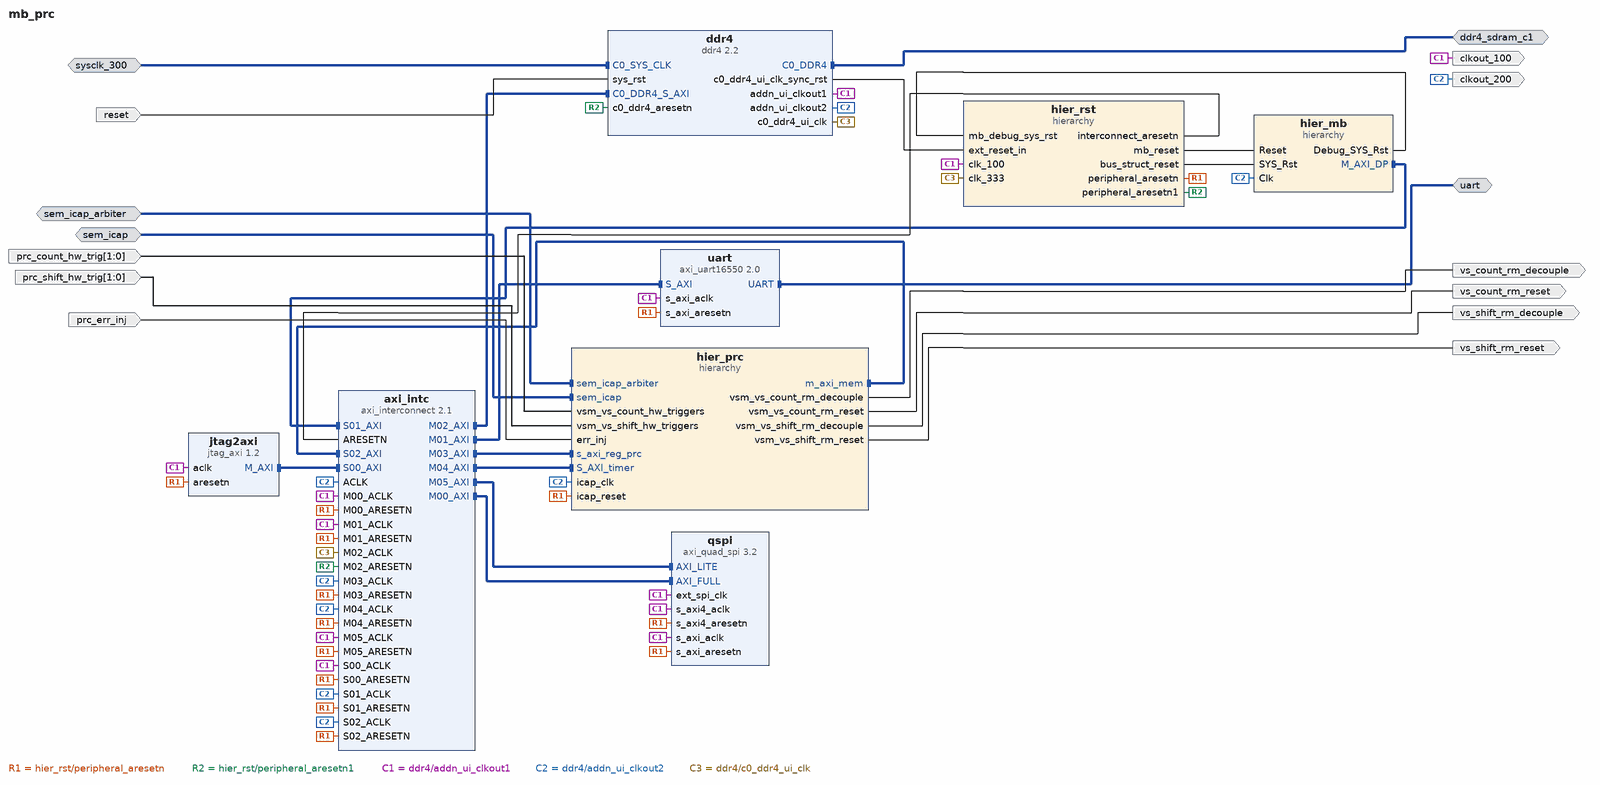
[diagram p0: block diagram of the top level]
# Vivado block design mb_prc, xcku5p-ffvb676-2-e, Vivado 2019.2
create_bd_design mb_prc

create_bd_intf_port -mode Master -vlnv xilinx.com:interface:ddr4_rtl:1.0 ddr4_sdram_c1
create_bd_intf_port -mode Slave -vlnv xilinx.com:interface:icap_rtl:1.0 sem_icap
create_bd_intf_port -mode Slave -vlnv xilinx.com:interface:cap_rtl:1.0 sem_icap_arbiter
create_bd_intf_port -mode Slave -vlnv xilinx.com:interface:diff_clock_rtl:1.0 sysclk_300
set_property -dict {CONFIG.FREQ_HZ 300000000} [get_bd_intf_ports sysclk_300]
create_bd_intf_port -mode Master -vlnv xilinx.com:interface:uart_rtl:1.0 uart
create_bd_port -dir I -type rst reset
set_property -dict {CONFIG.POLARITY ACTIVE_HIGH} [get_bd_ports reset]
create_bd_port -dir O -type clk clkout_100
create_bd_port -dir O -type clk clkout_200
create_bd_port -dir O vs_count_rm_decouple
create_bd_port -dir O vs_count_rm_reset
create_bd_port -dir O vs_shift_rm_decouple
create_bd_port -dir O vs_shift_rm_reset
create_bd_port -dir I -from 1 -to 0 prc_count_hw_trig
create_bd_port -dir I -from 1 -to 0 prc_shift_hw_trig
create_bd_port -dir I prc_err_inj

create_bd_cell -type hier hier_mb
create_bd_cell -type hier hier_prc
create_bd_cell -type hier hier_rst
create_bd_cell -type ip -vlnv xilinx.com:ip:axi_interconnect:2.1 axi_intc
set_property -dict {CONFIG.NUM_MI 6 CONFIG.NUM_SI 3 CONFIG.SYNCHRONIZATION_STAGES 2} [get_bd_cells axi_intc]
create_bd_cell -type ip -vlnv xilinx.com:ip:ddr4:2.2 ddr4
set_property -dict [list \
  CONFIG.ADDN_UI_CLKOUT1_FREQ_HZ 100 \
  CONFIG.ADDN_UI_CLKOUT2_FREQ_HZ 200 \
  CONFIG.C0.BANK_GROUP_WIDTH 1 \
  CONFIG.C0.DDR4_AxiAddressWidth 30 \
  CONFIG.C0_CLOCK_BOARD_INTERFACE default_sysclk1_300 \
  CONFIG.C0_DDR4_BOARD_INTERFACE ddr4_sdram_c1 \
  CONFIG.RESET_BOARD_INTERFACE reset \
] [get_bd_cells ddr4]
create_bd_cell -type ip -vlnv xilinx.com:ip:jtag_axi:1.2 jtag2axi
create_bd_cell -type ip -vlnv xilinx.com:ip:axi_quad_spi:3.2 qspi
set_property -dict [list \
  CONFIG.C_SPI_MEMORY 2 \
  CONFIG.C_SPI_MEM_ADDR_BITS 32 \
  CONFIG.C_SPI_MODE 2 \
  CONFIG.C_TYPE_OF_AXI4_INTERFACE 1 \
  CONFIG.C_USE_STARTUP 1 \
  CONFIG.C_USE_STARTUP_INT 1 \
  CONFIG.C_XIP_MODE 1 \
] [get_bd_cells qspi]
create_bd_cell -type ip -vlnv xilinx.com:ip:axi_uart16550:2.0 uart
set_property -dict {CONFIG.UART_BOARD_INTERFACE rs232_uart CONFIG.USE_BOARD_FLOW true} [get_bd_cells uart]

# ---- hierarchy /hier_mb ----
current_bd_instance /hier_mb
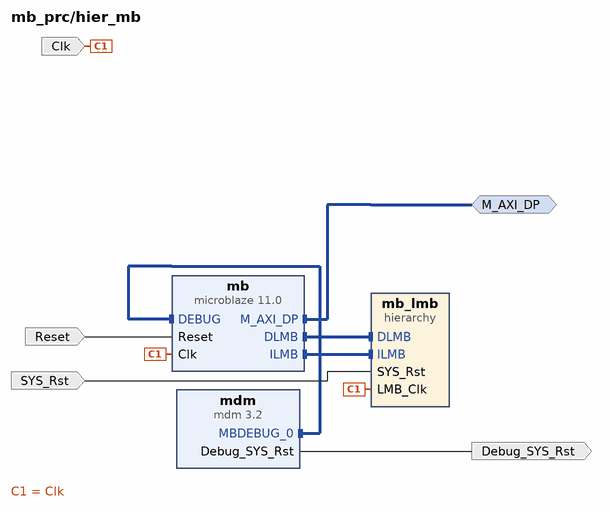
[diagram p1: block diagram inside /hier_mb]
create_bd_intf_pin -mode Master -vlnv xilinx.com:interface:aximm_rtl:1.0 M_AXI_DP
create_bd_pin -dir I -type clk Clk
create_bd_pin -dir I -type rst Reset
create_bd_pin -dir I SYS_Rst
create_bd_pin -dir O -type rst Debug_SYS_Rst

create_bd_cell -type hier mb_lmb
create_bd_cell -type ip -vlnv xilinx.com:ip:microblaze:11.0 mb
set_property -dict {CONFIG.C_DEBUG_ENABLED 1 CONFIG.C_D_AXI 1 CONFIG.C_D_LMB 1 CONFIG.C_I_LMB 1} [get_bd_cells mb]
create_bd_cell -type ip -vlnv xilinx.com:ip:mdm:3.2 mdm

# ---- hierarchy /hier_mb/mb_lmb ----
current_bd_instance /hier_mb/mb_lmb
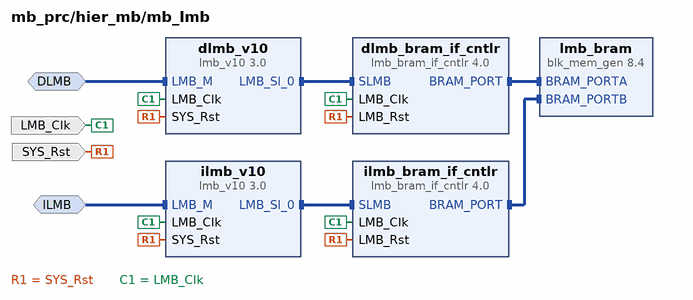
[diagram p2: block diagram inside /hier_mb/mb_lmb]
create_bd_intf_pin -mode MirroredMaster -vlnv xilinx.com:interface:lmb_rtl:1.0 DLMB
create_bd_intf_pin -mode MirroredMaster -vlnv xilinx.com:interface:lmb_rtl:1.0 ILMB
create_bd_pin -dir I -type clk LMB_Clk
create_bd_pin -dir I -type rst SYS_Rst

create_bd_cell -type ip -vlnv xilinx.com:ip:lmb_v10:3.0 dlmb_v10
create_bd_cell -type ip -vlnv xilinx.com:ip:lmb_v10:3.0 ilmb_v10
create_bd_cell -type ip -vlnv xilinx.com:ip:lmb_bram_if_cntlr:4.0 dlmb_bram_if_cntlr
set_property -dict {CONFIG.C_ECC 0} [get_bd_cells dlmb_bram_if_cntlr]
create_bd_cell -type ip -vlnv xilinx.com:ip:lmb_bram_if_cntlr:4.0 ilmb_bram_if_cntlr
set_property -dict {CONFIG.C_ECC 0} [get_bd_cells ilmb_bram_if_cntlr]
create_bd_cell -type ip -vlnv xilinx.com:ip:blk_mem_gen:8.4 lmb_bram
set_property -dict [list \
  CONFIG.EN_SAFETY_CKT false \
  CONFIG.Enable_B Use_ENB_Pin \
  CONFIG.Memory_Type True_Dual_Port_RAM \
  CONFIG.Port_B_Clock 100 \
  CONFIG.Port_B_Enable_Rate 100 \
  CONFIG.Port_B_Write_Rate 50 \
  CONFIG.Use_RSTB_Pin true \
  CONFIG.use_bram_block BRAM_Controller \
] [get_bd_cells lmb_bram]

# ---- hierarchy /hier_prc ----
current_bd_instance /hier_prc
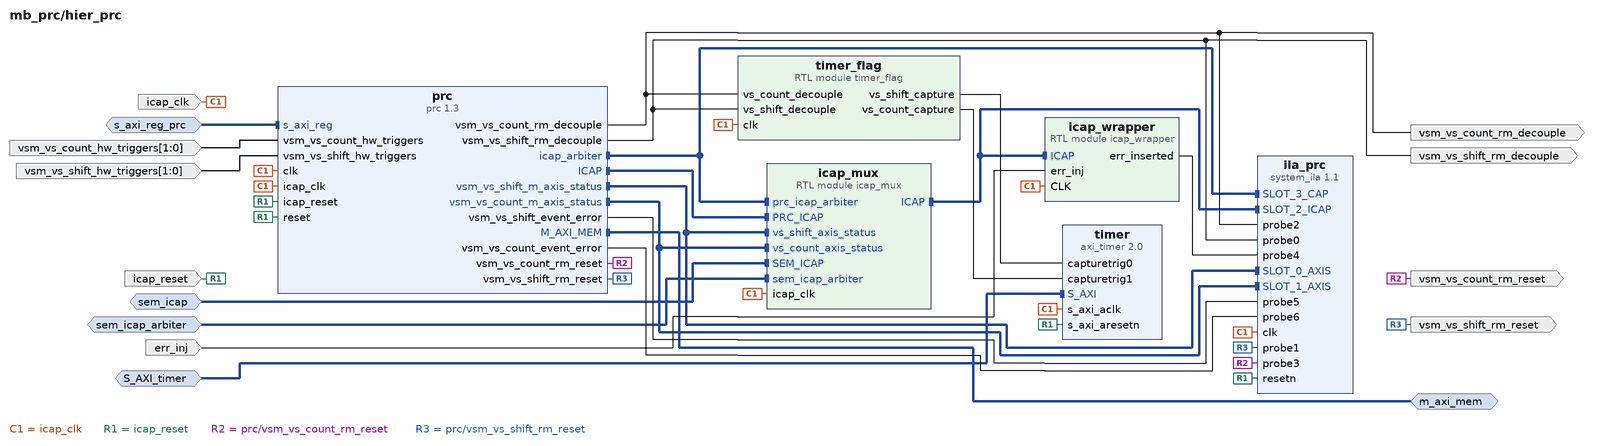
[diagram p3: block diagram inside /hier_prc]
create_bd_intf_pin -mode Master -vlnv xilinx.com:interface:aximm_rtl:1.0 m_axi_mem
create_bd_intf_pin -mode Slave -vlnv xilinx.com:interface:aximm_rtl:1.0 S_AXI_timer
create_bd_intf_pin -mode Slave -vlnv xilinx.com:interface:aximm_rtl:1.0 s_axi_reg_prc
create_bd_intf_pin -mode Slave -vlnv xilinx.com:interface:icap_rtl:1.0 sem_icap
create_bd_intf_pin -mode Slave -vlnv xilinx.com:interface:cap_rtl:1.0 sem_icap_arbiter
create_bd_pin -dir I -type clk icap_clk
create_bd_pin -dir I -type rst icap_reset
create_bd_pin -dir I -from 1 -to 0 vsm_vs_count_hw_triggers
create_bd_pin -dir I -from 1 -to 0 vsm_vs_shift_hw_triggers
create_bd_pin -dir I err_inj
create_bd_pin -dir O vsm_vs_count_rm_decouple
create_bd_pin -dir O vsm_vs_count_rm_reset
create_bd_pin -dir O vsm_vs_shift_rm_decouple
create_bd_pin -dir O vsm_vs_shift_rm_reset

create_bd_cell -type module -reference icap_wrapper icap_wrapper
create_bd_cell -type module -reference timer_flag timer_flag
create_bd_cell -type module -reference icap_mux icap_mux
create_bd_cell -type ip -vlnv xilinx.com:ip:system_ila:1.1 ila_prc
set_property -dict [list \
  CONFIG.C_MON_TYPE MIX \
  CONFIG.C_NUM_MONITOR_SLOTS 4 \
  CONFIG.C_NUM_OF_PROBES 7 \
  CONFIG.C_SLOT 3 \
  CONFIG.C_SLOT_0_INTF_TYPE xilinx.com:interface:axis_rtl:1.0 \
  CONFIG.C_SLOT_1_INTF_TYPE xilinx.com:interface:axis_rtl:1.0 \
  CONFIG.C_SLOT_2_INTF_TYPE xilinx.com:interface:icap_rtl:1.0 \
  CONFIG.C_SLOT_3_INTF_TYPE xilinx.com:interface:cap_rtl:1.0 \
] [get_bd_cells ila_prc]
create_bd_cell -type ip -vlnv xilinx.com:ip:prc:1.3 prc
set_property -dict [list \
  CONFIG.ALL_PARAMS {HAS_AXI_LITE_IF 1 RESET_ACTIVE_LEVEL 0 CP_FIFO_DEPTH 32 CP_FIFO_TYPE lutram CDC_STAGES 6 VS {vs_shift {ID 0 NAME vs_shift RM {rm_shift_right {ID 0 NAME rm_shift_right BS {0 {ID 0 ADDR 0 SIZE 0 CLEAR 0}} RESET_REQUIRED high} rm_shift_left {ID 1 NAME rm_shift_left BS {0 {ID 0 ADDR 0 SIZE 0 CLEAR 0}} RESET_REQUIRED high}} POR_RM rm_shift_right NUM_HW_TRIGGERS 2 HAS_POR_RM 1 HAS_AXIS_CONTROL 0 HAS_AXIS_STATUS 1} vs_count {ID 1 NAME vs_count RM {rm_count_up {ID 0 NAME rm_count_up BS {0 {ID 0 ADDR 0 SIZE 0 CLEAR 0}} RESET_REQUIRED high} rm_count_down {ID 1 NAME rm_count_down BS {0 {ID 0 ADDR 0 SIZE 0 CLEAR 0}} RESET_REQUIRED high}} NUM_HW_TRIGGERS 2 HAS_POR_RM 1 POR_RM rm_count_up HAS_AXIS_STATUS 1}} CP_FAMILY ultrascale_plus DIRTY 0 CP_ARBITRATION_PROTOCOL 1 CP_COMPRESSION 0} \
  CONFIG.GUI_CP_ARBITRATION_PROTOCOL 1 \
  CONFIG.GUI_RM_NEW_NAME rm_count_up \
  CONFIG.GUI_RM_RESET_REQUIRED high \
  CONFIG.GUI_SELECT_RM 0 \
  CONFIG.GUI_SELECT_TRIGGER_0 0 \
  CONFIG.GUI_SELECT_TRIGGER_1 1 \
  CONFIG.GUI_SELECT_TRIGGER_2 0 \
  CONFIG.GUI_SELECT_TRIGGER_3 1 \
  CONFIG.GUI_SELECT_VS 1 \
  CONFIG.GUI_VS_HAS_AXIS_CONTROL false \
  CONFIG.GUI_VS_HAS_AXIS_STATUS true \
  CONFIG.GUI_VS_HAS_POR_RM true \
  CONFIG.GUI_VS_NEW_NAME vs_count \
  CONFIG.GUI_VS_NUM_HW_TRIGGERS 2 \
  CONFIG.GUI_VS_POR_RM 0 \
] [get_bd_cells prc]
create_bd_cell -type ip -vlnv xilinx.com:ip:axi_timer:2.0 timer

# ---- hierarchy /hier_rst ----
current_bd_instance /hier_rst
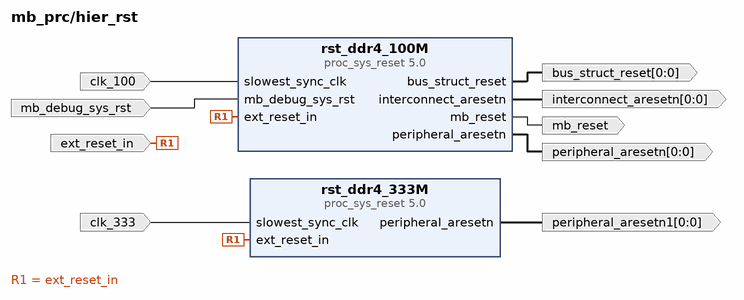
[diagram p4: block diagram inside /hier_rst]
create_bd_pin -dir I -type clk clk_100
create_bd_pin -dir I -type clk clk_333
create_bd_pin -dir I -type rst ext_reset_in
create_bd_pin -dir I -type rst mb_debug_sys_rst
create_bd_pin -dir O -type rst mb_reset
create_bd_pin -dir O -from 0 -to 0 -type rst bus_struct_reset
create_bd_pin -dir O -from 0 -to 0 -type rst interconnect_aresetn
create_bd_pin -dir O -from 0 -to 0 -type rst peripheral_aresetn
create_bd_pin -dir O -from 0 -to 0 -type rst peripheral_aresetn1

create_bd_cell -type ip -vlnv xilinx.com:ip:proc_sys_reset:5.0 rst_ddr4_100M
create_bd_cell -type ip -vlnv xilinx.com:ip:proc_sys_reset:5.0 rst_ddr4_333M
set_property -dict {CONFIG.RESET_BOARD_INTERFACE reset CONFIG.USE_BOARD_FLOW true} [get_bd_cells rst_ddr4_333M]

# ---- connections ----

current_bd_instance /hier_mb
connect_bd_intf_net [get_bd_intf_pins mb_lmb/DLMB] [get_bd_intf_pins mb/DLMB]
connect_bd_intf_net [get_bd_intf_pins mb_lmb/ILMB] [get_bd_intf_pins mb/ILMB]
connect_bd_intf_net [get_bd_intf_pins mdm/MBDEBUG_0] [get_bd_intf_pins mb/DEBUG]
connect_bd_intf_net [get_bd_intf_pins M_AXI_DP] [get_bd_intf_pins mb/M_AXI_DP]
connect_bd_net [get_bd_pins SYS_Rst] [get_bd_pins mb_lmb/SYS_Rst]
connect_bd_net [get_bd_pins mdm/Debug_SYS_Rst] [get_bd_pins Debug_SYS_Rst]
connect_bd_net -net mb_clk [get_bd_pins Clk] [get_bd_pins mb_lmb/LMB_Clk] [get_bd_pins mb/Clk]
connect_bd_net -net mb_reset [get_bd_pins Reset] [get_bd_pins mb/Reset]
set_property HDL_ATTRIBUTE.BMM_INFO_PROCESSOR {microblaze-le > mb_prc hier_mb/mb_lmb/dlmb_bram_if_cntlr} [get_bd_cells mb]
set_property HDL_ATTRIBUTE.KEEP_HIERARCHY yes [get_bd_cells mb]

current_bd_instance /hier_mb/mb_lmb
connect_bd_intf_net -intf_net mb_dlmb_bus [get_bd_intf_pins dlmb_bram_if_cntlr/SLMB] [get_bd_intf_pins dlmb_v10/LMB_Sl_0]
connect_bd_intf_net -intf_net mb_ilmb [get_bd_intf_pins ILMB] [get_bd_intf_pins ilmb_v10/LMB_M]
connect_bd_intf_net -intf_net mb_dlmb_cntlr [get_bd_intf_pins dlmb_bram_if_cntlr/BRAM_PORT] [get_bd_intf_pins lmb_bram/BRAM_PORTA]
connect_bd_intf_net -intf_net mb_dlmb [get_bd_intf_pins DLMB] [get_bd_intf_pins dlmb_v10/LMB_M]
connect_bd_intf_net -intf_net mb_ilmb_cntlr [get_bd_intf_pins ilmb_bram_if_cntlr/BRAM_PORT] [get_bd_intf_pins lmb_bram/BRAM_PORTB]
connect_bd_intf_net -intf_net mb_ilmb_bus [get_bd_intf_pins ilmb_bram_if_cntlr/SLMB] [get_bd_intf_pins ilmb_v10/LMB_Sl_0]
connect_bd_net [get_bd_pins SYS_Rst] \
  [get_bd_pins dlmb_v10/SYS_Rst] [get_bd_pins ilmb_v10/SYS_Rst] [get_bd_pins dlmb_bram_if_cntlr/LMB_Rst] \
  [get_bd_pins ilmb_bram_if_cntlr/LMB_Rst]
connect_bd_net -net mb_clk [get_bd_pins LMB_Clk] \
  [get_bd_pins dlmb_v10/LMB_Clk] [get_bd_pins ilmb_v10/LMB_Clk] [get_bd_pins dlmb_bram_if_cntlr/LMB_Clk] \
  [get_bd_pins ilmb_bram_if_cntlr/LMB_Clk]
set_property HDL_ATTRIBUTE.BMM_INFO_ADDRESS_SPACE {byte  0x00000000 32 > mb_prc hier_mb/mb_lmb/lmb_bram} [get_bd_cells dlmb_bram_if_cntlr]
set_property HDL_ATTRIBUTE.KEEP_HIERARCHY yes [get_bd_cells dlmb_bram_if_cntlr]

current_bd_instance /hier_prc
connect_bd_intf_net -intf_net prc_axi4_reg [get_bd_intf_pins s_axi_reg_prc] [get_bd_intf_pins prc/s_axi_reg]
connect_bd_intf_net [get_bd_intf_pins S_AXI_timer] [get_bd_intf_pins timer/S_AXI]
connect_bd_intf_net [get_bd_intf_pins sem_icap] [get_bd_intf_pins icap_mux/SEM_ICAP]
connect_bd_intf_net [get_bd_intf_pins icap_mux/prc_icap_arbiter] [get_bd_intf_pins prc/icap_arbiter]
connect_bd_intf_net [get_bd_intf_pins icap_mux/prc_icap_arbiter] [get_bd_intf_pins ila_prc/SLOT_3_CAP]
connect_bd_intf_net [get_bd_intf_pins prc/vsm_vs_shift_m_axis_status] [get_bd_intf_pins icap_mux/vs_shift_axis_status]
connect_bd_intf_net [get_bd_intf_pins prc/vsm_vs_shift_m_axis_status] [get_bd_intf_pins ila_prc/SLOT_0_AXIS]
connect_bd_intf_net [get_bd_intf_pins icap_mux/PRC_ICAP] [get_bd_intf_pins prc/ICAP]
connect_bd_intf_net [get_bd_intf_pins sem_icap_arbiter] [get_bd_intf_pins icap_mux/sem_icap_arbiter]
connect_bd_intf_net [get_bd_intf_pins m_axi_mem] [get_bd_intf_pins prc/M_AXI_MEM]
connect_bd_intf_net [get_bd_intf_pins icap_mux/ICAP] [get_bd_intf_pins icap_wrapper/ICAP]
connect_bd_intf_net [get_bd_intf_pins icap_mux/ICAP] [get_bd_intf_pins ila_prc/SLOT_2_ICAP]
connect_bd_intf_net [get_bd_intf_pins prc/vsm_vs_count_m_axis_status] [get_bd_intf_pins icap_mux/vs_count_axis_status]
connect_bd_intf_net [get_bd_intf_pins prc/vsm_vs_count_m_axis_status] [get_bd_intf_pins ila_prc/SLOT_1_AXIS]
connect_bd_net -net clk_200 [get_bd_pins icap_clk] \
  [get_bd_pins icap_wrapper/CLK] [get_bd_pins timer_flag/clk] [get_bd_pins icap_mux/icap_clk] [get_bd_pins ila_prc/clk] \
  [get_bd_pins prc/clk] [get_bd_pins prc/icap_clk] [get_bd_pins timer/s_axi_aclk]
connect_bd_net -net rst_peripheral_aresetn [get_bd_pins icap_reset] \
  [get_bd_pins ila_prc/resetn] [get_bd_pins prc/reset] [get_bd_pins prc/icap_reset] [get_bd_pins timer/s_axi_aresetn]
connect_bd_net [get_bd_pins err_inj] [get_bd_pins icap_wrapper/err_inj]
connect_bd_net -net icap_err_inserted [get_bd_pins icap_wrapper/err_inserted] [get_bd_pins ila_prc/probe4]
connect_bd_net -net prc_vs_count_rm_decouple [get_bd_pins prc/vsm_vs_count_rm_decouple] \
  [get_bd_pins vsm_vs_count_rm_decouple] [get_bd_pins timer_flag/vs_count_decouple] [get_bd_pins ila_prc/probe2]
connect_bd_net -net prc_vs_count_rm_reset [get_bd_pins prc/vsm_vs_count_rm_reset] [get_bd_pins vsm_vs_count_rm_reset] [get_bd_pins ila_prc/probe3]
connect_bd_net -net prc_vs_shift_rm_decouple [get_bd_pins prc/vsm_vs_shift_rm_decouple] \
  [get_bd_pins vsm_vs_shift_rm_decouple] [get_bd_pins timer_flag/vs_shift_decouple] [get_bd_pins ila_prc/probe0]
connect_bd_net -net prc_vs_shift_rm_reset [get_bd_pins prc/vsm_vs_shift_rm_reset] [get_bd_pins vsm_vs_shift_rm_reset] [get_bd_pins ila_prc/probe1]
connect_bd_net [get_bd_pins vsm_vs_count_hw_triggers] [get_bd_pins prc/vsm_vs_count_hw_triggers]
connect_bd_net [get_bd_pins vsm_vs_shift_hw_triggers] [get_bd_pins prc/vsm_vs_shift_hw_triggers]
connect_bd_net [get_bd_pins prc/vsm_vs_shift_event_error] [get_bd_pins ila_prc/probe5]
connect_bd_net [get_bd_pins prc/vsm_vs_count_event_error] [get_bd_pins ila_prc/probe6]
connect_bd_net [get_bd_pins timer_flag/vs_shift_capture] [get_bd_pins timer/capturetrig0]
connect_bd_net [get_bd_pins timer_flag/vs_count_capture] [get_bd_pins timer/capturetrig1]

current_bd_instance /hier_rst
connect_bd_net -net peripheral_aresetn [get_bd_pins rst_ddr4_100M/peripheral_aresetn] [get_bd_pins peripheral_aresetn]
connect_bd_net -net peripheral_aresetn1 [get_bd_pins rst_ddr4_333M/peripheral_aresetn] [get_bd_pins peripheral_aresetn1]
connect_bd_net -net SYS_Rst_1 [get_bd_pins rst_ddr4_100M/bus_struct_reset] [get_bd_pins bus_struct_reset]
connect_bd_net -net reset [get_bd_pins ext_reset_in] [get_bd_pins rst_ddr4_100M/ext_reset_in] [get_bd_pins rst_ddr4_333M/ext_reset_in]
connect_bd_net [get_bd_pins clk_100] [get_bd_pins rst_ddr4_100M/slowest_sync_clk]
connect_bd_net [get_bd_pins clk_333] [get_bd_pins rst_ddr4_333M/slowest_sync_clk]
connect_bd_net -net hier_mb_Debug_SYS_Rst [get_bd_pins mb_debug_sys_rst] [get_bd_pins rst_ddr4_100M/mb_debug_sys_rst]
connect_bd_net [get_bd_pins rst_ddr4_100M/interconnect_aresetn] [get_bd_pins interconnect_aresetn]
connect_bd_net [get_bd_pins rst_ddr4_100M/mb_reset] [get_bd_pins mb_reset]

current_bd_instance /
connect_bd_intf_net [get_bd_intf_pins axi_intc/M01_AXI] [get_bd_intf_pins uart/S_AXI]
connect_bd_intf_net -intf_net axi_uart16550_UART [get_bd_intf_ports uart] [get_bd_intf_pins uart/UART]
connect_bd_intf_net [get_bd_intf_pins axi_intc/M03_AXI] [get_bd_intf_pins hier_prc/s_axi_reg_prc]
connect_bd_intf_net [get_bd_intf_pins axi_intc/S01_AXI] [get_bd_intf_pins hier_mb/M_AXI_DP]
connect_bd_intf_net [get_bd_intf_pins axi_intc/M05_AXI] [get_bd_intf_pins qspi/AXI_LITE]
connect_bd_intf_net [get_bd_intf_ports sem_icap_arbiter] [get_bd_intf_pins hier_prc/sem_icap_arbiter]
connect_bd_intf_net -intf_net default_sysclk1_300_1 [get_bd_intf_ports sysclk_300] [get_bd_intf_pins ddr4/C0_SYS_CLK]
connect_bd_intf_net [get_bd_intf_pins axi_intc/S00_AXI] [get_bd_intf_pins jtag2axi/M_AXI]
connect_bd_intf_net [get_bd_intf_pins axi_intc/M04_AXI] [get_bd_intf_pins hier_prc/S_AXI_timer]
connect_bd_intf_net [get_bd_intf_pins axi_intc/M00_AXI] [get_bd_intf_pins qspi/AXI_FULL]
connect_bd_intf_net [get_bd_intf_pins axi_intc/M02_AXI] [get_bd_intf_pins ddr4/C0_DDR4_S_AXI]
connect_bd_intf_net [get_bd_intf_pins axi_intc/S02_AXI] [get_bd_intf_pins hier_prc/m_axi_mem]
connect_bd_intf_net [get_bd_intf_ports sem_icap] [get_bd_intf_pins hier_prc/sem_icap]
connect_bd_intf_net [get_bd_intf_ports ddr4_sdram_c1] [get_bd_intf_pins ddr4/C0_DDR4]
connect_bd_net [get_bd_ports reset] [get_bd_pins ddr4/sys_rst]
connect_bd_net -net rst_100M_interconnect_aresetn [get_bd_pins hier_rst/interconnect_aresetn] [get_bd_pins axi_intc/ARESETN]
connect_bd_net -net rst_100M_mb_reset [get_bd_pins hier_rst/mb_reset] [get_bd_pins hier_mb/Reset]
connect_bd_net -net rst_100M_peripheral_aresetn [get_bd_pins hier_rst/peripheral_aresetn] \
  [get_bd_pins hier_prc/icap_reset] [get_bd_pins axi_intc/S00_ARESETN] [get_bd_pins axi_intc/M00_ARESETN] \
  [get_bd_pins axi_intc/M01_ARESETN] [get_bd_pins axi_intc/S01_ARESETN] [get_bd_pins axi_intc/S02_ARESETN] \
  [get_bd_pins axi_intc/M03_ARESETN] [get_bd_pins axi_intc/M04_ARESETN] [get_bd_pins axi_intc/M05_ARESETN] \
  [get_bd_pins jtag2axi/aresetn] [get_bd_pins qspi/s_axi_aresetn] [get_bd_pins qspi/s_axi4_aresetn] \
  [get_bd_pins uart/s_axi_aresetn]
connect_bd_net -net rst_333M_peripheral_aresetn [get_bd_pins hier_rst/peripheral_aresetn1] \
  [get_bd_pins axi_intc/M02_ARESETN] [get_bd_pins ddr4/c0_ddr4_aresetn]
connect_bd_net -net mb_SYS_Rst [get_bd_pins hier_rst/bus_struct_reset] [get_bd_pins hier_mb/SYS_Rst]
connect_bd_net -net ddr4_ui_clk_sync_rst [get_bd_pins ddr4/c0_ddr4_ui_clk_sync_rst] [get_bd_pins hier_rst/ext_reset_in]
connect_bd_net [get_bd_pins hier_mb/Debug_SYS_Rst] [get_bd_pins hier_rst/mb_debug_sys_rst]
connect_bd_net -net clk_100 [get_bd_pins ddr4/addn_ui_clkout1] \
  [get_bd_ports clkout_100] [get_bd_pins hier_rst/clk_100] [get_bd_pins axi_intc/S00_ACLK] [get_bd_pins axi_intc/M00_ACLK] \
  [get_bd_pins axi_intc/M01_ACLK] [get_bd_pins axi_intc/M05_ACLK] [get_bd_pins jtag2axi/aclk] [get_bd_pins qspi/ext_spi_clk] \
  [get_bd_pins qspi/s_axi_aclk] [get_bd_pins qspi/s_axi4_aclk] [get_bd_pins uart/s_axi_aclk]
connect_bd_net -net clk_200 [get_bd_pins ddr4/addn_ui_clkout2] \
  [get_bd_ports clkout_200] [get_bd_pins hier_mb/Clk] [get_bd_pins hier_prc/icap_clk] [get_bd_pins axi_intc/ACLK] \
  [get_bd_pins axi_intc/S01_ACLK] [get_bd_pins axi_intc/S02_ACLK] [get_bd_pins axi_intc/M03_ACLK] \
  [get_bd_pins axi_intc/M04_ACLK]
connect_bd_net -net clk_333 [get_bd_pins ddr4/c0_ddr4_ui_clk] [get_bd_pins hier_rst/clk_333] [get_bd_pins axi_intc/M02_ACLK]
connect_bd_net [get_bd_pins hier_prc/vsm_vs_count_rm_decouple] [get_bd_ports vs_count_rm_decouple]
connect_bd_net [get_bd_pins hier_prc/vsm_vs_count_rm_reset] [get_bd_ports vs_count_rm_reset]
connect_bd_net [get_bd_pins hier_prc/vsm_vs_shift_rm_decouple] [get_bd_ports vs_shift_rm_decouple]
connect_bd_net [get_bd_pins hier_prc/vsm_vs_shift_rm_reset] [get_bd_ports vs_shift_rm_reset]
connect_bd_net -net vsm_vs_count_hw_triggers [get_bd_ports prc_count_hw_trig] [get_bd_pins hier_prc/vsm_vs_count_hw_triggers]
connect_bd_net -net vsm_vs_shift_hw_triggers [get_bd_ports prc_shift_hw_trig] [get_bd_pins hier_prc/vsm_vs_shift_hw_triggers]
connect_bd_net -net err_inj [get_bd_ports prc_err_inj] [get_bd_pins hier_prc/err_inj]

# ---- address map ----
assign_bd_address -offset 0x00000000 -range 64K -target_address_space [get_bd_addr_spaces hier_mb/mb/Data] [get_bd_addr_segs hier_mb/mb_lmb/dlmb_bram_if_cntlr/SLMB/Mem]
assign_bd_address -offset 0x41C00000 -range 64K -target_address_space [get_bd_addr_spaces hier_mb/mb/Data] [get_bd_addr_segs hier_prc/timer/S_AXI/Reg]
assign_bd_address -offset 0x44A00000 -range 64K -target_address_space [get_bd_addr_spaces hier_mb/mb/Data] [get_bd_addr_segs hier_prc/prc/s_axi_reg/Reg]
assign_bd_address -offset 0x44A10000 -range 64K -target_address_space [get_bd_addr_spaces hier_mb/mb/Data] [get_bd_addr_segs qspi/AXI_LITE/Reg]
assign_bd_address -offset 0x44A20000 -range 64K -target_address_space [get_bd_addr_spaces hier_mb/mb/Data] [get_bd_addr_segs uart/S_AXI/Reg]
assign_bd_address -offset 0x60000000 -range 32M -target_address_space [get_bd_addr_spaces hier_mb/mb/Data] [get_bd_addr_segs qspi/aximm/MEM0]
assign_bd_address -offset 0x80000000 -range 1G -target_address_space [get_bd_addr_spaces hier_mb/mb/Data] [get_bd_addr_segs ddr4/C0_DDR4_MEMORY_MAP/C0_DDR4_ADDRESS_BLOCK]
assign_bd_address -offset 0x00000000 -range 64K -target_address_space [get_bd_addr_spaces hier_mb/mb/Instruction] [get_bd_addr_segs hier_mb/mb_lmb/ilmb_bram_if_cntlr/SLMB/Mem]
assign_bd_address -offset 0x41C00000 -range 64K -target_address_space [get_bd_addr_spaces hier_prc/prc/Data] [get_bd_addr_segs hier_prc/timer/S_AXI/Reg]
assign_bd_address -offset 0x44A00000 -range 64K -target_address_space [get_bd_addr_spaces hier_prc/prc/Data] [get_bd_addr_segs hier_prc/prc/s_axi_reg/Reg]
assign_bd_address -offset 0x44A10000 -range 64K -target_address_space [get_bd_addr_spaces hier_prc/prc/Data] [get_bd_addr_segs qspi/AXI_LITE/Reg]
assign_bd_address -offset 0x44A20000 -range 64K -target_address_space [get_bd_addr_spaces hier_prc/prc/Data] [get_bd_addr_segs uart/S_AXI/Reg]
assign_bd_address -offset 0x60000000 -range 32M -target_address_space [get_bd_addr_spaces hier_prc/prc/Data] [get_bd_addr_segs qspi/aximm/MEM0]
assign_bd_address -offset 0x80000000 -range 1G -target_address_space [get_bd_addr_spaces hier_prc/prc/Data] [get_bd_addr_segs ddr4/C0_DDR4_MEMORY_MAP/C0_DDR4_ADDRESS_BLOCK]
assign_bd_address -offset 0x41C00000 -range 64K -target_address_space [get_bd_addr_spaces jtag2axi/Data] [get_bd_addr_segs hier_prc/timer/S_AXI/Reg]
assign_bd_address -offset 0x44A00000 -range 64K -target_address_space [get_bd_addr_spaces jtag2axi/Data] [get_bd_addr_segs hier_prc/prc/s_axi_reg/Reg]
assign_bd_address -offset 0x44A10000 -range 64K -target_address_space [get_bd_addr_spaces jtag2axi/Data] [get_bd_addr_segs qspi/AXI_LITE/Reg]
assign_bd_address -offset 0x44A20000 -range 64K -target_address_space [get_bd_addr_spaces jtag2axi/Data] [get_bd_addr_segs uart/S_AXI/Reg]
assign_bd_address -offset 0x60000000 -range 32M -target_address_space [get_bd_addr_spaces jtag2axi/Data] [get_bd_addr_segs qspi/aximm/MEM0]
assign_bd_address -offset 0x80000000 -range 1G -target_address_space [get_bd_addr_spaces jtag2axi/Data] [get_bd_addr_segs ddr4/C0_DDR4_MEMORY_MAP/C0_DDR4_ADDRESS_BLOCK]

validate_bd_design
save_bd_design
